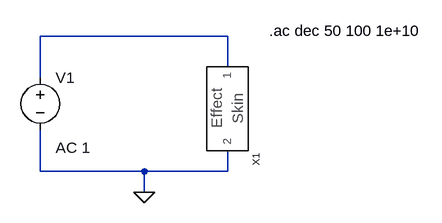
[diagram p0: schematic Test_SE.asc]
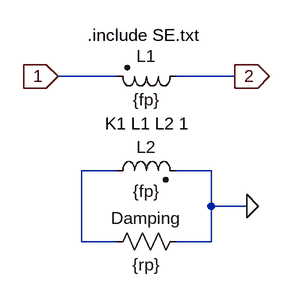
[diagram p1: sub-circuit skin_effect.asc]
Test_SE.asc, the LTspice schematic file:
Version 4
SHEET 1 880 680
WIRE 368 96 80 96
WIRE 368 144 368 96
WIRE 80 160 80 96
WIRE 80 304 80 240
WIRE 240 304 80 304
WIRE 368 304 368 272
WIRE 368 304 240 304
WIRE 240 336 240 304
FLAG 240 336 0
SYMBOL Skin_Effect 368 208 R90
SYMATTR InstName X1
SYMBOL voltage 80 144 R0
WINDOW 123 24 124 Left 2
WINDOW 39 0 0 Left 2
SYMATTR Value2 AC 1
SYMATTR InstName V1
SYMATTR Value ""
TEXT 432 88 Left 2 !.ac dec 50 100 1e+10

skin_effect.asc, the sub-circuit schematic file:
Version 4
SHEET 1 880 680
WIRE 128 80 48 80
WIRE 288 80 208 80
WIRE 128 208 80 208
WIRE 256 208 208 208
WIRE 256 256 256 208
WIRE 304 256 256 256
WIRE 80 304 80 208
WIRE 128 304 80 304
WIRE 256 304 256 256
WIRE 256 304 208 304
FLAG 48 80 1
IOPIN 48 80 In
FLAG 288 80 2
IOPIN 288 80 Out
FLAG 304 256 0
SYMBOL ind2 224 64 R90
WINDOW 0 4 56 VBottom 2
WINDOW 3 32 56 VTop 2
SYMATTR InstName L1
SYMATTR Value {fp}
SYMBOL ind2 112 224 R270
WINDOW 0 32 56 VTop 2
WINDOW 3 4 56 VBottom 2
SYMATTR InstName L2
SYMATTR Value {fp}
SYMBOL res 224 288 R90
WINDOW 0 0 56 VBottom 2
WINDOW 3 32 56 VTop 2
SYMATTR InstName Damping
SYMATTR Value {rp}
TEXT 112 144 Left 2 !K1 L1 L2 1
TEXT 88 24 Left 2 !.include SE.txt

The netlist it stands for:
* Test_SE.asc
XX1 N001 0 skin_effect
V1 N001 0 AC 1

* block symbol definitions
.subckt skin_effect 1 2
L1 2 1 {fp}
L2 N001 0 {fp}
R§Damping 0 N001 {rp}
K1 L1 L2 1
.include SE.txt
.ends skin_effect

.ac dec 50 100 1e+10
.backanno
.end